# Altium schematic sheet TmpLightHumBaro.SchDoc
size A4
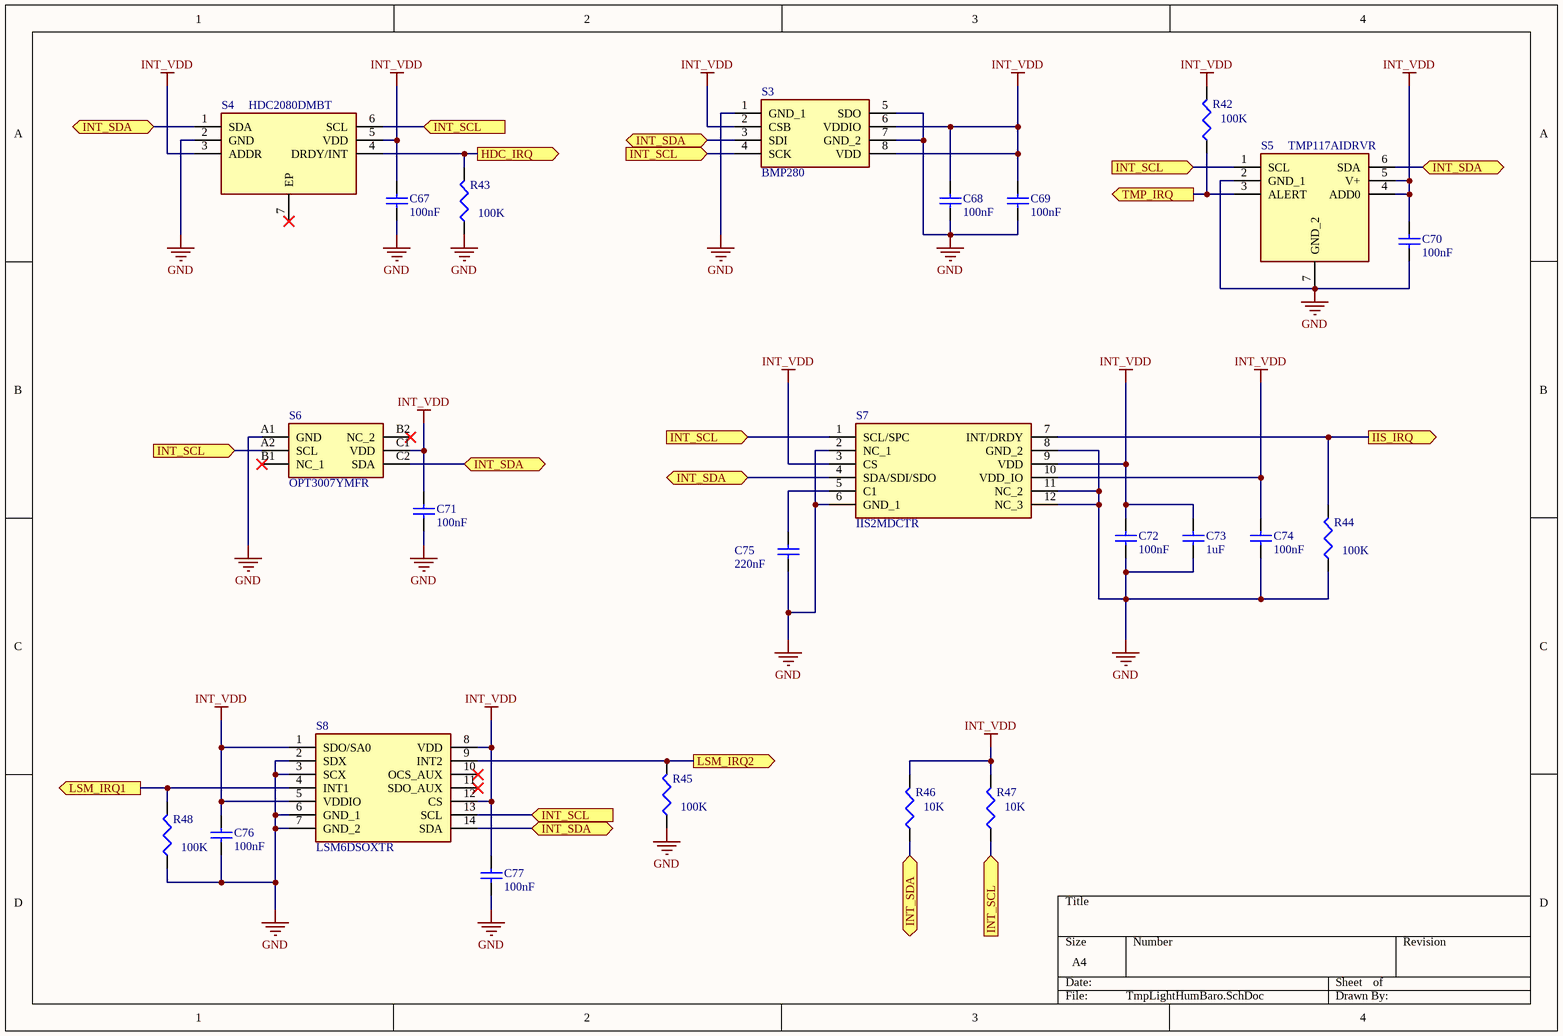
[diagram p0: TmpLightHumBaro.SchDoc]

## Parts
C67  100nF  [CAPC1608X90X35NL10T15]
C68  100nF  [CAPC1608X90X35NL10T15]
C69  100nF  [CAPC1608X90X35NL10T15]
C70  100nF  [CAPC1608X90X35NL10T15]
C71  100nF  [CAPC1608X90X35NL10T15]
C72  100nF  [CAPC1608X90X35NL10T15]
C73  1uF  [CAPC1608X90X35NL10T15]
C74  100nF  [CAPC1608X90X35NL10T15]
C75  220nF  [CAPC1608X90X35NL10T15]
C76  100nF  [CAPC1608X90X35NL10T15]
C77  100nF  [CAPC1608X90X35NL10T15]
R42  value 100K  [J1-0603]
R43  value 100K  [J1-0603]
R44  value 100K  [J1-0603]
R45  value 100K  [J1-0603]
R46  value 10K  [J1-0603]
R47  value 10K  [J1-0603]
R48  value 100K  [J1-0603]
S3  BMP280  [8-PIN-METAL-LID-LGA_1]
S4  HDC2080DMBT  [SON100P300X300X80-7N-D]
S5  TMP117AIDRVR  [SON65P200X200X80-7N]
S6  OPT3007YMFR  [BGA6C35P2X3_86X95X23]
S7  IIS2MDCTR  [IIS2MDCTR]
S8  LSM6DSOXTR  [LGA-14_1]

## Ports
HDC_IRQ (out), IIS_IRQ (out), INT_SCL (in), INT_SDA (bidir), LSM_IRQ1 (out), LSM_IRQ2 (out), TMP_IRQ (out)

## Nets
GND: C67.2 C68.2 C69.2 C70.2 C71.2 C72.2 C73.2 C74.2 C75.2 C76.2 C77.2 R43.1 R44.1 R45.1 R48.1 S3.1(GND_1) S3.5(SDO) S3.7(GND_2) S4.2(GND) S5.2(GND_1) S5.7(GND_2) S6.A1(GND) S7.2(NC_1) S7.6(GND_1) S7.8(GND_2) S7.11(NC_2) S7.12(NC_3) S8.2(SDX) S8.3(SCX) S8.6(GND_1) S8.7(GND_2)
INT_VDD: C67.1 C68.1 C69.1 C70.1 C71.1 C72.1 C73.1 C74.1 C76.1 C77.1 R42.2 R46.2 R47.2 S3.2(CSB) S3.6(VDDIO) S3.8(VDD) S4.3(ADDR) S4.5(VDD) S5.4(ADD0) S5.5(V+) S6.C1(VDD) S7.3(CS) S7.9(VDD) S7.10(VDD_IO) S8.1(SDO/SA0) S8.5(VDDIO) S8.8(VDD) S8.12(CS)
HDC_IRQ: R43.2 S4.4(DRDY/INT) ; port HDC_IRQ
IIS_IRQ: R44.2 S7.7(INT/DRDY) ; port IIS_IRQ
INT_SCL: R47.1 S3.4(SCK) S4.6(SCL) S5.1(SCL) S6.A2(SCL) S7.1(SCL/SPC) S8.13(SCL) ; port INT_SCL
INT_SDA: R46.1 S3.3(SDI) S4.1(SDA) S5.6(SDA) S6.C2(SDA) S7.4(SDA/SDI/SDO) S8.14(SDA) ; port INT_SDA
LSM_IRQ1: R48.2 S8.4(INT1) ; port LSM_IRQ1
LSM_IRQ2: R45.2 S8.9(INT2) ; port LSM_IRQ2
TMP_IRQ: R42.1 S5.3(ALERT) ; port TMP_IRQ
NetC75_1: C75.1 S7.5(C1)

Not connected (* = marked no-connect by the designer): S4 7(EP)*; S6 B1(NC_1)* B2(NC_2)*; S8 10(OCS_AUX)* 11(SDO_AUX)*

## Library data of the parts
C67-C77 = CMP-2006-02891-1: Part Number: GRM188R71H102KA01D; Manufacturer: Murata
R42-R48 = Res3: Resistor; Published: 8-Jun-2000; LatestRevisionDate: 29-May-2009; LatestRevisionNote: IPC-7351 Footprint Added.; PackageReference: J1-0603; Publisher: Altium Limited; PackageDescription: Chip Resistor
S3 = BMP280: Integrated Circuit; Manufacturer_Name: Bosch; Datasheet Link: https://ae-bst.resource.bosch.com/media/_tech/media/datasheets/BST-BMP280-DS001-19.pdf; Manufacturer_Part_Number: BMP280; Mouser Part Number: 262-BMP280
S4 = HDC2080DMBT: Undefined or Miscellaneous; Manufacturer_Name: Texas Instruments; Datasheet Link: http://www.ti.com/lit/gpn/hdc2080; Height: 0.8mm; Manufacturer_Part_Number: HDC2080DMBT; Mouser Part Number: 595-HDC2080DMBT; Mouser Price/Stock: https://www.mouser.com/Search/Refine.aspx?Keyword=595-HDC2080DMBT; RS Part Number: 1797065P; RS Price/Stock: http://uk.rs-online.com/web/p/products/1797065P
S5 = TMP117AIDRVR: Integrated Circuit; Manufacturer_Name: Texas Instruments; Datasheet Link: http://www.ti.com/lit/gpn/tmp117; Height: 0.8mm; Manufacturer_Part_Number: TMP117AIDRVR; Mouser Part Number: 595-TMP117AIDRVR; Mouser Price/Stock: https://www.mouser.com/Search/Refine.aspx?Keyword=595-TMP117AIDRVR
S6 = OPT3007YMFR: Integrated Circuit; Manufacturer_Name: Texas Instruments; Datasheet Link: http://www.ti.com/lit/gpn/opt3007; Height: 0.226mm; Manufacturer_Part_Number: OPT3007YMFR; Mouser Part Number: 595-OPT3007YMFR; Mouser Price/Stock: https://www.mouser.com/Search/Refine.aspx?Keyword=595-OPT3007YMFR
S7 = IIS2MDCTR: Integrated Circuit; Manufacturer_Name: STMicroelectronics; Datasheet Link: https://www.st.com/resource/en/datasheet/iis2mdc.pdf; Height: 0.7mm; Manufacturer_Part_Number: IIS2MDCTR; Mouser Part Number: 511-IIS2MDCTR; Mouser Price/Stock: https://www.mouser.com/Search/Refine.aspx?Keyword=511-IIS2MDCTR
S8 = LSM6DSOXTR: Accelerometer; Manufacturer_Name: STMicroelectronics; Datasheet Link: https://www.st.com/resource/en/datasheet/lsm6dsox.pdf; Manufacturer_Part_Number: LSM6DSOXTR; Mouser Part Number: 511-LSM6DSOXTR; Mouser Price/Stock: https://www.mouser.com/Search/Refine.aspx?Keyword=511-LSM6DSOXTR